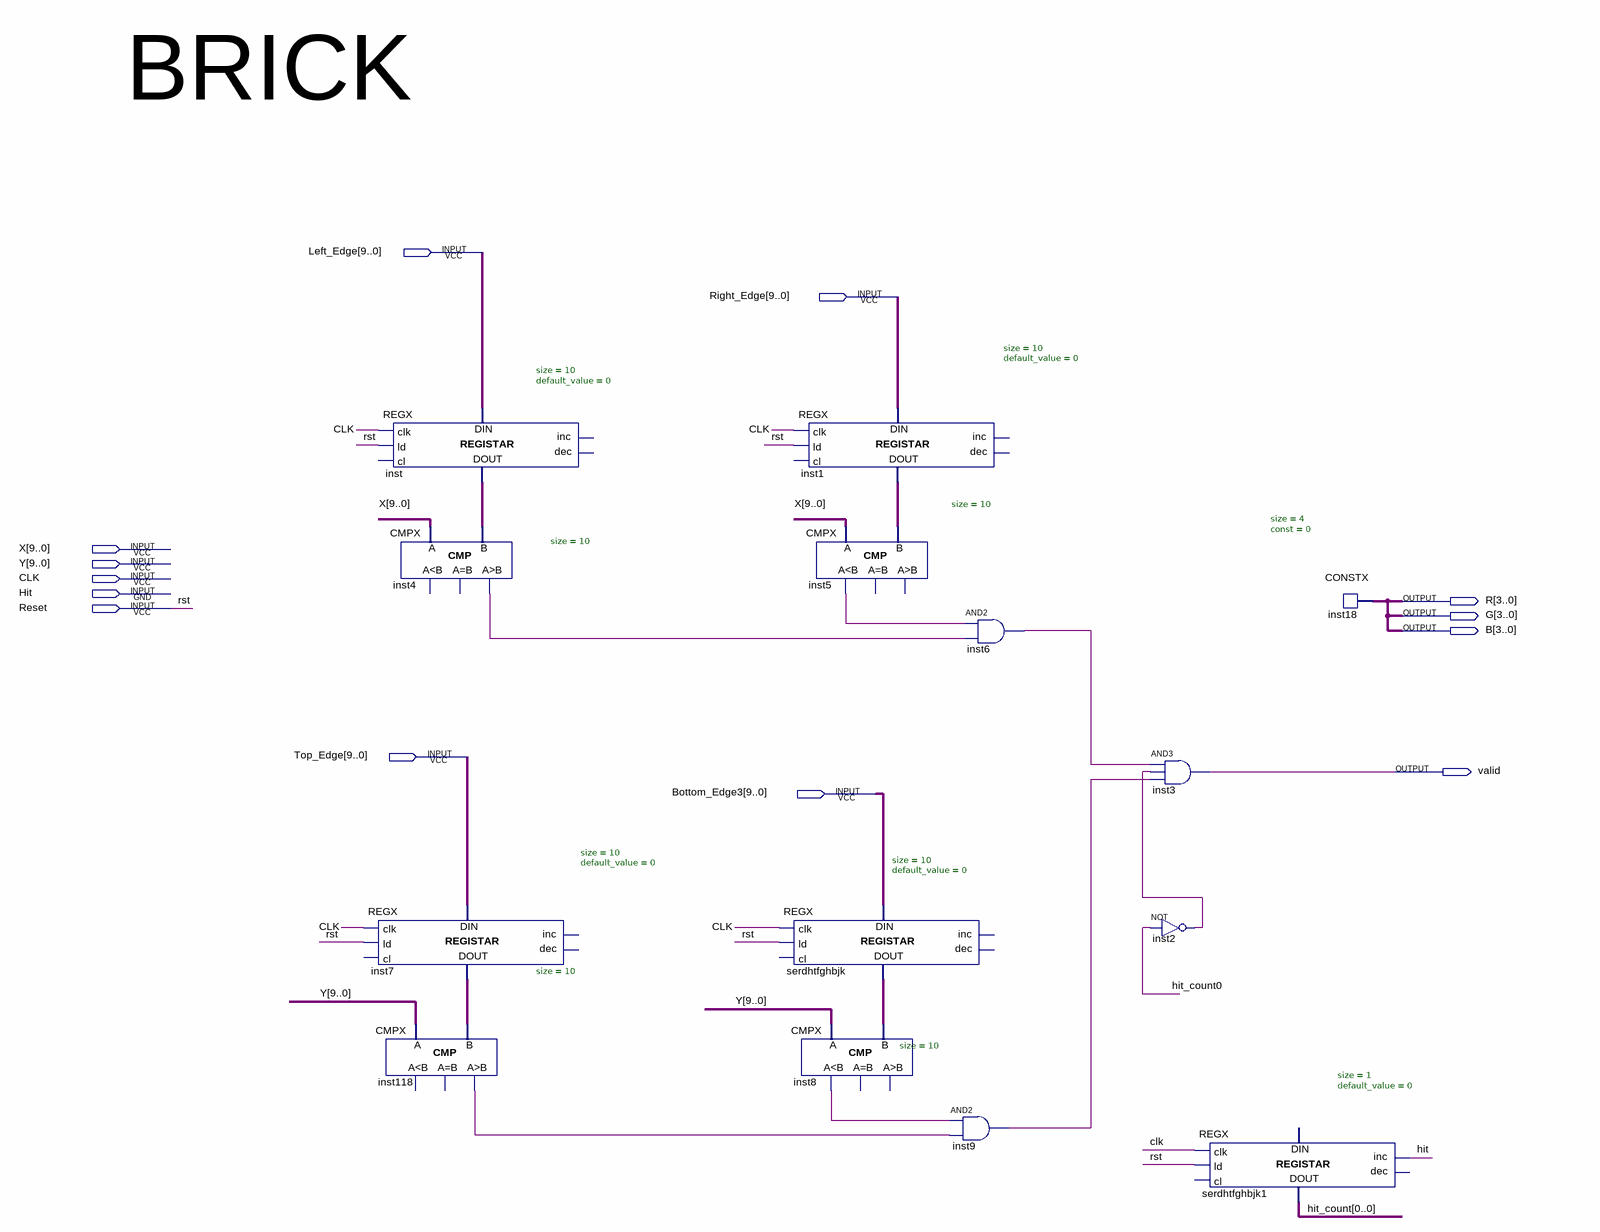
[diagram p0: schematic sheet]
// Quartus schematic brick.bdf as structural Verilog: 14 symbols, 13 pins
module brick (
  input  [9:0] Left_Edge,
  input  [9:0] Right_Edge,
  input  [9:0] X,
  input  [9:0] Y,
  input  CLK,
  input  Hit,
  input  Reset,
  input  [9:0] Top_Edge,
  input  [9:0] Bottom_Edge3,
  output [3:0] R,
  output [3:0] G,
  output [3:0] B,
  output valid
);

  wire inst2_out, inst4_gr, inst5_ls, inst6_out, inst8_ls, inst9_out, inst118_gr;
  wire [0:0] hit_count;
  wire [9:0] inst1_data_out, inst7_data_out, inst_data_out, serdhtfghbjk_data_out;

  REGX #(.size(10), .default_value(0)) inst (
    .clk(CLK), .ld(Reset), .data_in(Left_Edge), .data_out(inst_data_out));  // open: cl, inc, dec
  CMPX #(.size(10)) inst4 (.A(X), .B(inst_data_out), .gr(inst4_gr));  // open: ls, eq
  REGX #(.size(10), .default_value(0)) inst7 (
    .clk(CLK), .ld(Reset), .data_in(Top_Edge), .data_out(inst7_data_out));  // open: cl, inc, dec
  CMPX #(.size(10)) inst118 (.A(Y), .B(inst7_data_out), .gr(inst118_gr));  // open: ls, eq
  REGX #(.size(10), .default_value(0)) inst1 (
    .clk(CLK), .ld(Reset), .data_in(Right_Edge), .data_out(inst1_data_out));  // open: cl, inc, dec
  CMPX #(.size(10)) inst5 (.A(X), .B(inst1_data_out), .ls(inst5_ls));  // open: eq, gr
  REGX #(.size(10), .default_value(0)) serdhtfghbjk (
    .clk(CLK), .ld(Reset), .data_in(Bottom_Edge3), .data_out(serdhtfghbjk_data_out));  // open: cl, inc, dec
  CMPX #(.size(10)) inst8 (.A(Y), .B(serdhtfghbjk_data_out), .ls(inst8_ls));  // open: eq, gr
  and inst6 (inst6_out, inst5_ls, inst4_gr);
  and inst9 (inst9_out, inst8_ls, inst118_gr);
  and inst3 (valid, inst6_out, inst2_out, inst9_out);
  not inst2 (inst2_out, hit_count[0]);
  REGX #(.size(1), .default_value(0)) serdhtfghbjk1 (
    .clk(CLK), .ld(Reset), .inc(Hit), .data_out(hit_count[0]));  // open: cl, dec, data_in
  CONSTX #(.size(4), .\const (0)) inst18 (.data(B));

  assign G = B;
  assign R = B;

  // Other names for the same wires on the sheet: rst = Reset

  // Notes on the sheet:
  //   BRICK
endmodule
